# EAGLE design PCB (EAGLE 6.3)
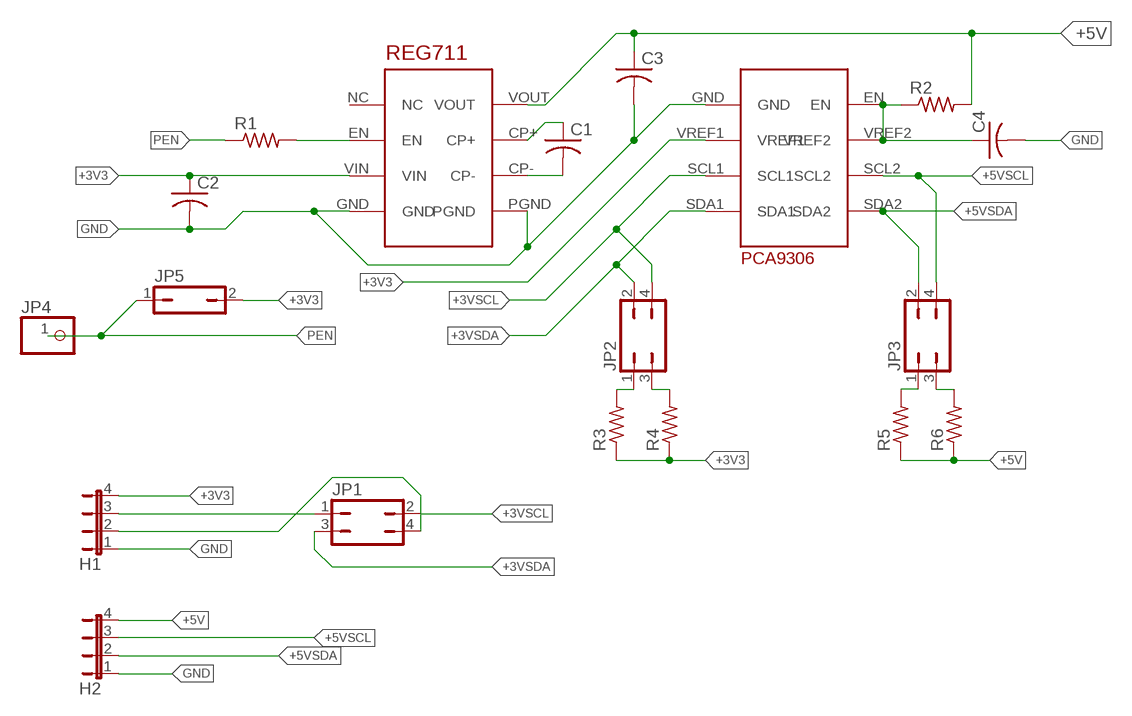
[diagram p0: schematic, sheet 1]

## Parts
C1  C-USC1206  [C1206]
C2  C-USC1206  [C1206]
C3  C-USC1206  [C1206]
C4  C-USC1206  [C1206]
H1  JP4E  [JP4]
H2  JP4E  [JP4]
JP1  JP2Q  [JP2Q]
JP2  JP2Q  [JP2Q]
JP3  JP2Q  [JP2Q]
JP4  PINHD-1X1  [1X01]
JP5  JP1Q  [JP1]
PCA9306  PCA9306  [PCA9306]
R1  R-US_0204/2V  [0204V]
R2  R-US_0204/2V  [0204V]
R3  R-US_0204/2V  [0204V]
R4  R-US_0204/2V  [0204V]
R5  R-US_0204/2V  [0204V]
R6  R-US_0204/2V  [0204V]
REG711  REG711  [REG711]

## Nets
+3V3: C2.1 H1.4 JP5.2 PCA9306.VREF1 R3.1 R4.1 REG711.VIN
+3VA: H1.3 JP1.1
+3VB: H1.2 JP1.4
+3VSCL: JP1.2 JP2.4 PCA9306.SCL1
+3VSDA: JP1.3 JP2.2 PCA9306.SDA1
+5V: C3.1 C4.1 H2.4 PCA9306.EN PCA9306.VREF2 R2.1 R2.2 R5.1 R6.1 REG711.VOUT
+5VSCL: H2.3 JP3.4 PCA9306.SCL2
+5VSDA: H2.2 JP3.2 PCA9306.SDA2
CP+: C1.1 REG711.CP+
CP-: C1.2 REG711.CP-
EN: R1.2 REG711.EN
GND: C2.2 C3.2 C4.2 H1.1 H2.1 PCA9306.GND REG711.GND REG711.PGND
N$1: JP2.1 R3.2
N$2: JP2.3 R4.2
N$3: JP3.1 R5.2
N$4: JP3.3 R6.2
PEN: JP4.1 JP5.1 R1.1
Unconnected: REG711.NC

## Library data of the parts
C1-C4 = adafruit:C-US: CAPACITOR, American symbol
H1 H2 = jumper:JP4E: JUMPER
JP1-JP3 = jumper:JP2Q: JUMPER
JP4 = adafruit:PINHD-1X1: Pin header 1x1 for 0.1" spacing With round pins
JP5 = jumper:JP1Q: JUMPER
PCA9306 = TI:PCA9306
R1-R6 = adafruit:R-US_: RESISTOR, American symbol
REG711 = TI:REG711

## Net classes
0 default: drill 0.61 mm

## Board
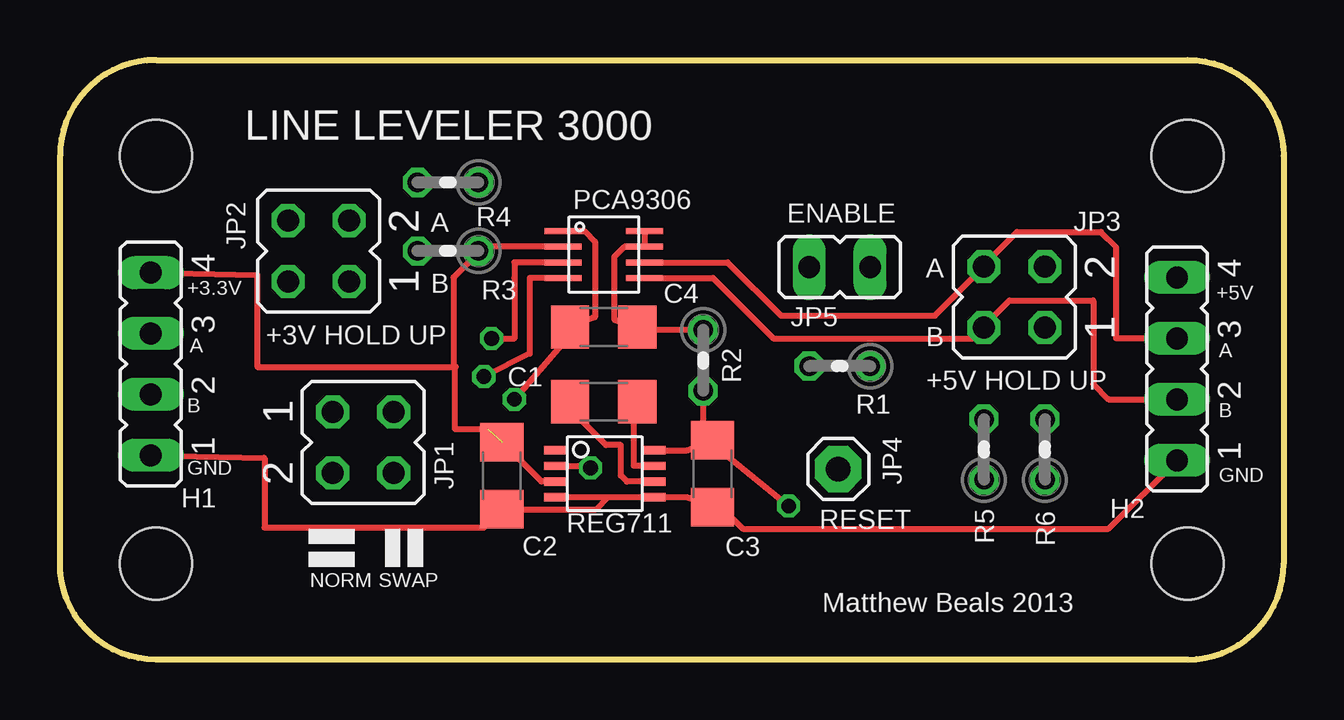
[diagram p1: board, top side]
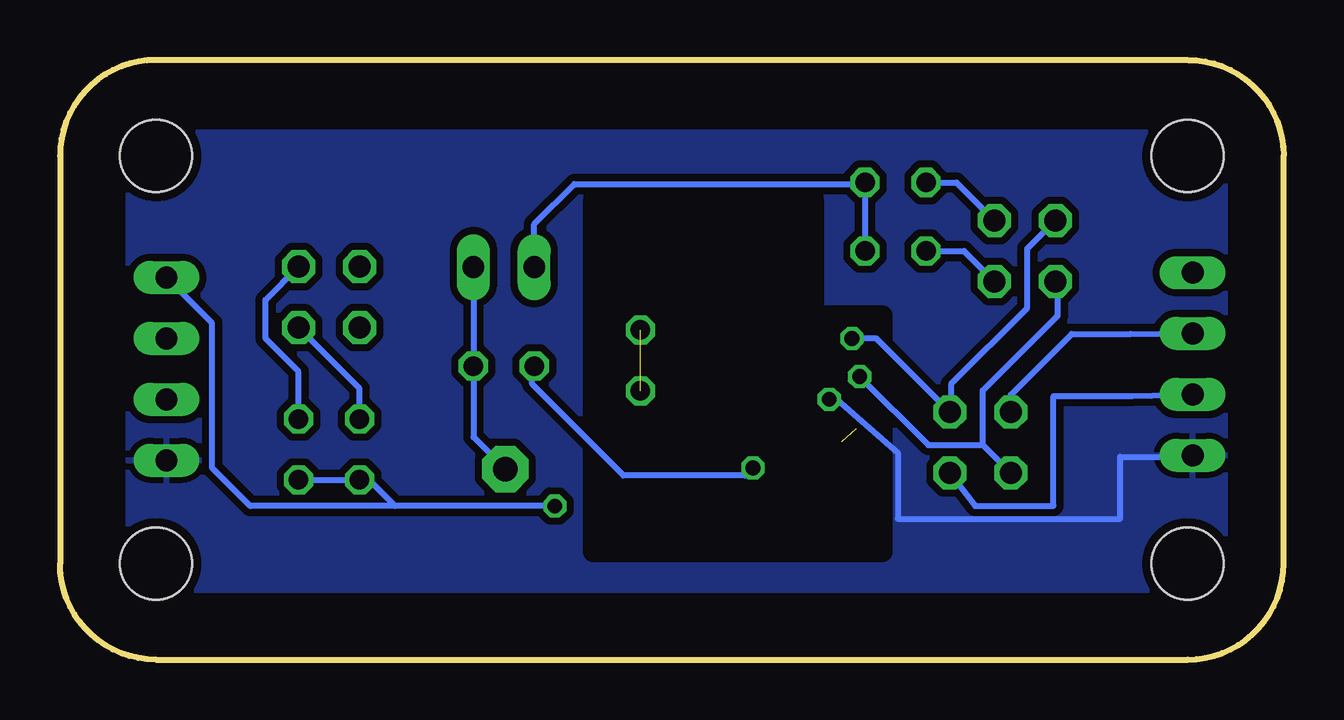
[diagram p2: board, bottom side, seen from below]

Size 51 x 25 mm. Coordinates in mm from the lower left corner, seen from the top.
Outline: 4,25 47,25 arc-90 51,21 51,4 arc-90 47,0 4,0 arc-90 0,4 0,21 arc-90 4,25
Copper layers (1*16): Top 0.0356mm / dielectric 1.5011mm / Bottom 0.0356mm
Design rules "LaenPCBOrder *": minimum track width 6mil, minimum drill 13mil, track to track 6mil, track to pad 6mil, pad to pad 6mil, via to via 6mil, smd to smd 6mil, copper to edge 15mil, drill to drill 6mil, minimum pad ring 7mil, minimum via ring 7mil, stop-mask expansion 4mil, vias tented up to drill 25mil, thermal gap 10mil
Holes 3 mm at 4,4 4,21 47,21 47,4
bRestrict: area 16.7,4.5 to 28.8,19.1

### Footprints (pad centres in the part's own frame; a part is rotated, then mirrored left to right if it is on the bottom)
C1206 = smd 1.6 x 1.8: 1 -1.4,0; 2 1.4,0
JP4 = drill 0.914 long: 1 -3.81,0; 2 -1.27,0; 3 1.27,0; 4 3.81,0
JP2Q = drill 0.914 octagon: 1 -1.27,-1.27; 2 -1.27,1.27; 3 1.27,-1.27; 4 1.27,1.27
1X01 = drill 1.016 pad 1.93 octagon: 1 0,0
JP1 = drill 0.914 long: 1 0,-1.27; 2 0,1.27
PCA9306 = smd 0.25 x 1.55: EN -0.975,1.7; GND -0.975,-1.7; SCL1 0.325,-1.7; SCL2 0.325,1.7; SDA1 0.975,-1.7; SDA2 0.975,1.7; VREF1 -0.325,-1.7; VREF2 -0.325,1.7
0204V = drill 0.813 octagon: 1 -1.27,0; 2 1.27,0
REG711 = smd 0.35 x 0.975: CP+ -0.325,2.04; CP- 0.325,2.04; EN -0.325,-2.04; GND 0.975,-2.04; NC -0.975,-2.04; PGND 0.975,2.04; VIN 0.325,-2.04; VOUT -0.975,2.04

### Placement (x,y rotation side)
C1  22.66,10.75 180 top
C2  18.42,7.67 270 top
C3  27.2,7.75 270 top
C4  22.66,13.87 180 top
H1  3.79,12.33 90 top
H2  46.56,12.12 90 top
JP1  12.64,9.05 270 top
JP2  10.78,17.03 90 top
JP3  39.78,15.11 90 top
JP4  32.44,7.94 270 top
JP5  32.5,16.36 90 top
PCA9306  22.67,16.88 270 top
R1  32.5,12.23 180 top
R2  26.81,12.47 270 top
R3  16.18,17.03 180 top
R4  16.18,19.89 180 top
R5  38.51,8.76 90 top
R6  41.05,8.76 90 top
REG711  22.71,7.75 270 top

### Tracks (layer width: path | path; a pad name or v marks a point on that pad's centre or on a via)
+3V3  (1 unrouted)
  Top 0.254: REG711.VIN 20.07,7.42 C2.1 | H1.4 8.22,16.03 8.22,12.21 16.45,12.21 | 16.49,12.21 16.45,12.21 | 16.45,12.21 16.45,9.62 17.82,9.62 | PCA9306.VREF1 17.62,17.21 R3.1 17.45,16.97 16.4,15.93 16.4,12.26 16.45,12.21
  Bottom 0.254: R3.1 R4.1 17.51,19.83 29.56,19.83 31.23,18.15 JP5.2
+3VA
  Bottom 0.254: JP1.1 11.37,11.04 8.83,13.58 6.37,13.58 H1.3
+3VB
  Bottom 0.254: JP1.4 12.85,6.4 9.61,6.4 9.59,6.41 9.59,10.99 6.32,10.99 H1.2
+3VSCL  (via drill 0.61)
  Top 0.254: 18.94,15.92 18.94,15.93 | 18.94,15.93 18.94,13.39 v17.99,13.39 | PCA9306.SCL1 18.94,16.56 18.94,15.93
  Bottom 0.254: v17.99,13.39 16.98,13.39 JP1.2 13.86,10.37 13.86,11.48 10.68,14.66 10.68,17.13 JP2.4
+3VSDA  (via drill 0.61)
  Top 0.254: 19.59,15.27 19.57,15.29 | 19.57,15.29 19.57,12.75 v17.67,11.8 | PCA9306.SDA1 19.57,15.91 19.57,15.29
  Bottom 0.254: v17.67,11.8 14.81,8.94 12.53,8.94 | 12.53,8.94 JP1.3 | 12.53,8.94 12.53,11.22 9.41,14.34 9.41,15.67 JP2.2
+5V  (via drill 0.61)  (1 unrouted)
  Top 0.254: REG711.VOUT 26.13,8.73 C3.1 | PCA9306.EN PCA9306.VREF2 23.52,17.21 23.1,16.78 23.1,14.18 C4.1 24.56,13.74 R2.1 | C3.1 26.99,9.15 v30.37,6.4 | R2.2 26.81,9.54 C3.1
  Bottom 0.254: v30.37,6.4 37.04,6.4 | 37.04,6.4 43.07,6.4 44.66,7.99 44.66,14.02 H2.4 | R5.1 R6.1 38.12,7.49 37.04,6.4
+5VSCL
  Top 0.254: H2.3 44.02,13.39 44.02,17.2 43.39,17.83 39.9,17.83 38.51,16.45 JP3.4 36.47,14.34 30.05,14.34 27.83,16.56 PCA9306.SCL2
+5VSDA
  Top 0.254: H2.2 43.7,10.85 43.07,11.48 43.07,14.98 39.58,14.98 38.51,13.91 JP3.2 38.06,13.39 29.73,13.39 27.21,15.91 PCA9306.SDA2
CP+
  Top 0.254: REG711.CP+ 23.92,8.08 23.92,10.61 C1.1 24.06,10.45 23.6,10.45
CP-
  Top 0.254: REG711.CP- 23.63,7.42 23.38,7.67 23.38,8.94 22.75,8.94 21.48,10.21 21.48,10.53 C1.2
EN  (via drill 0.61)
  Top 0.254: REG711.EN 22.03,8.08 v22.11,7.99
  Bottom 0.254: v22.11,7.99 22.43,7.67 27.51,7.67 31.32,11.48 31.32,12.14 R1.2
GND  (via drill 0.61)
  Top 0.254: REG711.GND 22.85,6.77 | 22.85,6.77 REG711.PGND 26.13,6.77 C3.2 27.56,6.35 28.47,5.45 43.7,5.45 H2.1 | 18.93,6.77 C2.2 22.34,6.27 22.85,6.77 | PCA9306.GND 21.88,17.86 22.3,17.44 22.3,14.28 C4.2 21,13.23 v18.94,10.85 | H1.1 8.51,8.41 8.53,8.4 8.53,5.5 17.67,5.5 18.43,6.26
  Bottom 0.254: v18.94,10.85 18.62,10.85 16.08,8.62 16.08,5.88 6.81,5.88 6.81,8.45 3.79,8.45 H1.1
  pour Bottom (isolate 0.305): 3.7,21.96 48.15,21.96 48.15,2.91 2.43,2.91 2.43,21.96
N$1
  Bottom 0.254: R3.2 13.32,17.03 JP2.1
N$2
  Bottom 0.254: R4.2 13.64,19.89 JP2.3
N$3
  Bottom 0.254: R5.2 38.51,11.3 JP3.1
N$4
  Bottom 0.254: R6.2 41.05,12.01 42.44,13.39 42.44,15 JP3.3
PEN
  Bottom 0.254: JP5.1 R1.1 33.77,9.27 JP4.1

### Text on the board
tNames: REG711
_tsilk: LINE LEVELER 3000 | A | ENABLE | A | +3.3V | B | +5V | A | +3V HOLD UP | B | A | +5V HOLD UP | B | B | GND | GND | RESET | NORM | SWAP | Matthew Beals 2013